# Altium schematic sheet mcf51jm128vlh.SchDoc
size B
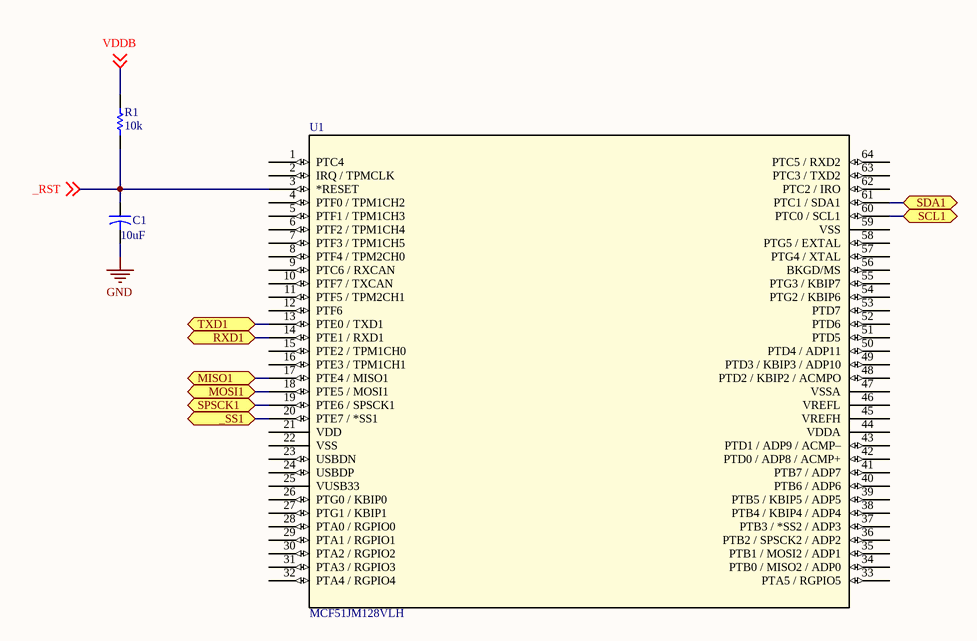
[diagram p0: mcf51jm128vlh.SchDoc]

## Parts
C1  value 10uF  [CAPR5-4X5]  (hidden comment: Cap2)
R1  value 10k  [AXIAL-0.3]  (hidden comment: Res1)
U1  MCF51JM128VLH  [QFP64_FRE]

## Ports
_SS1, MISO1, MOSI1, RXD1, SCL1, SDA1, SPSCK1, TXD1

## Nets
GND: C1.2
_RST: C1.1 R1.1 U1.3(*RESET) ; off-sheet _RST
_SS1: U1.20(PTE7_/_*SS1) ; port _SS1
MISO1: U1.17(PTE4_/_MISO1) ; port MISO1
MOSI1: U1.18(PTE5_/_MOSI1) ; port MOSI1
RXD1: U1.14(PTE1_/_RXD1) ; port RXD1
SCL1: U1.60(PTC0_/_SCL1) ; port SCL1
SDA1: U1.61(PTC1_/_SDA1) ; port SDA1
SPSCK1: U1.19(PTE6_/_SPSCK1) ; port SPSCK1
TXD1: U1.13(PTE0_/_TXD1) ; port TXD1
VDDB: R1.2 ; off-sheet VDDB

Not connected (* = marked no-connect by the designer): U1 1(PTC4) 2(IRQ_/_TPMCLK) 4(PTF0_/_TPM1CH2) 5(PTF1_/_TPM1CH3) 6(PTF2_/_TPM1CH4) 7(PTF3_/_TPM1CH5) 8(PTF4_/_TPM2CH0) 9(PTC6_/_RXCAN) 10(PTF7_/_TXCAN) 11(PTF5_/_TPM2CH1) 12(PTF6) 15(PTE2_/_TPM1CH0) 16(PTE3_/_TPM1CH1) 21(VDD) 22(VSS) 23(USBDN) 24(USBDP) 25(VUSB33) 26(PTG0_/_KBIP0) 27(PTG1_/_KBIP1) 28(PTA0_/_RGPIO0) 29(PTA1_/_RGPIO1) 30(PTA2_/_RGPIO2) 31(PTA3_/_RGPIO3) 32(PTA4_/_RGPIO4) 33(PTA5_/_RGPIO5) 34(PTB0_/_MISO2_/_ADP0) 35(PTB1_/_MOSI2_/_ADP1) 36(PTB2_/_SPSCK2_/_ADP2) 37(PTB3_/_*SS2_/_ADP3) 38(PTB4_/_KBIP4_/_ADP4) 39(PTB5_/_KBIP5_/_ADP5) 40(PTB6_/_ADP6) 41(PTB7_/_ADP7) 42(PTD0_/_ADP8_/_ACMP+) 43(PTD1_/_ADP9_/_ACMP–) 44(VDDA) 45(VREFH) 46(VREFL) 47(VSSA) 48(PTD2_/_KBIP2_/_ACMPO) 49(PTD3_/_KBIP3_/_ADP10) 50(PTD4_/_ADP11) 51(PTD5) 52(PTD6) 53(PTD7) 54(PTG2_/_KBIP6) 55(PTG3_/_KBIP7) 56(BKGD/MS) 57(PTG4_/_XTAL) 58(PTG5_/_EXTAL) 59(VSS) 62(PTC2_/_IRO) 63(PTC3_/_TXD2) 64(PTC5_/_RXD2)

## Library data of the parts
C1 = Cap2: Capacitor; Published: 23-Sep-2002; PackageReference: CAPR5-4X5; Publisher: Altium Limited; PackageDescription: Capacitor; 2 Leads
R1 = Res1: Resistor; Published: 8-Jun-2000; LatestRevisionDate: 17-Jul-2002; LatestRevisionNote: Re-released for DXP Platform.; PackageReference: AXIAL-0.3; Publisher: Altium Limited; PackageDescription: Axial Device, Thru-Hole; 2 Leads; 0.3 in Pin Spacing
U1 = MCF51JM128VLH: No Description Available; Mfr_Name: NXP / Freescale; RefDes: RefDes; Type: Type